# EAGLE design laser_buck_driver (EAGLE 7.6.0)
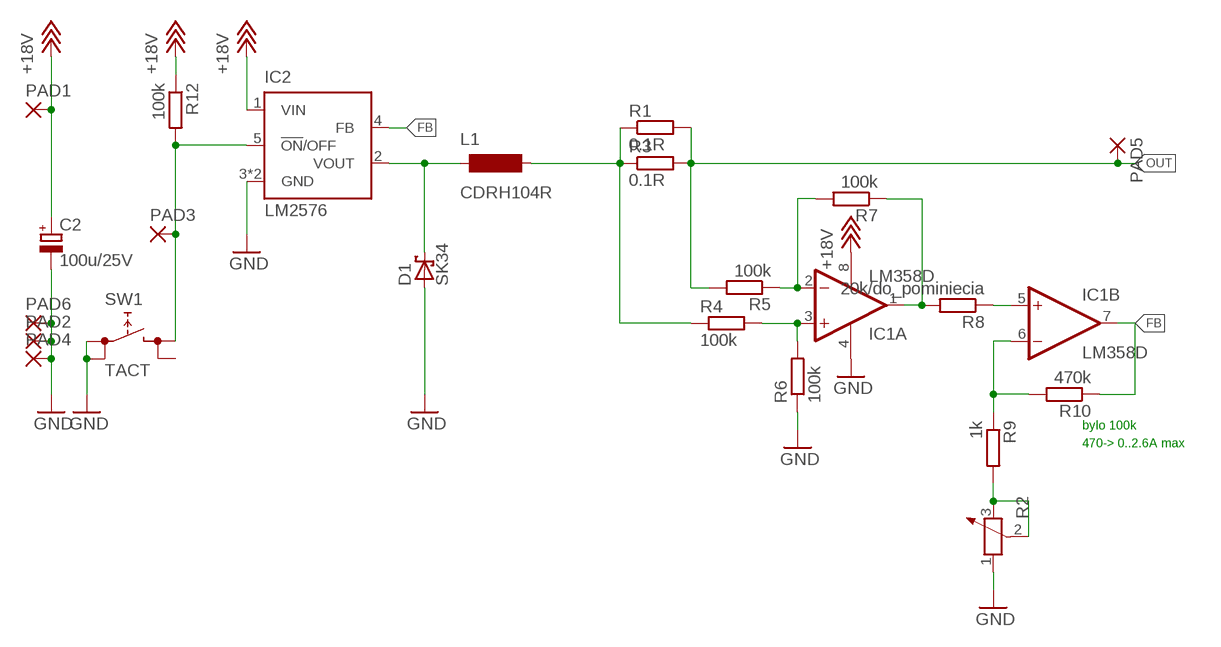
[diagram p0: schematic, sheet 1]

## Parts
C2  100u/25V  CPOL-EU153CLV-0810  [153CLV-0810]
D1  SK34  [SMA(DO214-AC)]
IC1  LM358D  [SO08]
IC2  LM2576  [TO263-5]
L1  CDRH104R  [CDRH104-R]
PAD1  SMD2  [SMD1,27-2,54]
PAD2  SMD2  [SMD1,27-2,54]
PAD3  SMD2  [SMD1,27-2,54]
PAD4  SMD2  [SMD1,27-2,54]
PAD5  SMD2  [SMD1,27-2,54]
PAD6  SMD2  [SMD1,27-2,54]
R1  0.1R  R-EU_R1206  [R1206]
R2  POTENTIOMETER_  [RTRIM_SMD_CUSTOM]
R3  0.1R  R-EU_R1206  [R1206]
R4  100k  R-EU_R0805  [R0805]
R5  100k  R-EU_R0805  [R0805]
R6  100k  R-EU_R0805  [R0805]
R7  100k  R-EU_R0805  [R0805]
R8  20k/do_pominiecia  R-EU_R0805  [R0805]
R9  1k  R-EU_R0805  [R0805]
R10  470k  R-EU_R0805  [R0805]
R12  100k  R-EU_R1206  [R1206]
SW1  TACT  [TACT]

## Nets
22K: IC1.5(B:+IN) R8.1
+18V: C2.+ IC1.8(P:V+) IC2.1(VIN) PAD1.1(P) R12.1
FB: IC1.7(B:OUT) IC2.4(FB) R10.1
GND: C2.- D1.A IC1.4(P:V-) IC2.3(GND) IC2.6(GND) PAD2.1(P) PAD4.1(P) PAD6.1(P) R2.1 R6.1 SW1.1 SW1.4
N$1: D1.C IC2.2(VOUT) L1.1
N$2: IC2.5(!ON!/OFF) PAD3.1(P) R12.2 SW1.2
N$3: IC1.1(A:OUT) R7.1 R8.2
N$8: L1.2 R1.1 R3.1 R4.1
N$11: IC1.6(B:-IN) R9.1 R10.2
N$12: IC1.2(A:-IN) R5.1 R7.2
N$13: IC1.3(A:+IN) R4.2 R6.2
N$15: R2.2 R2.3 R9.2
OUT: PAD5.1(P) R1.2 R3.2 R5.2
Unconnected: SW1.3

## Notes on the sheet
- bylo 100k
- 470-> 0..2.6A max

## Library data of the parts
C2 = rcl:CPOL-EU: POLARIZED CAPACITOR, European symbol
D1 = miscrel:SK34: Schottky barrier rectifier diode 3A, 40V
IC1 = linear:LM358: OP AMP also LM158; LM258; LM2904 Source: http://cache.national.com/ds/LM/LM158.pdf
IC2 = TI:LM2576: Simple Switch buck, step down dc-dc converter 3A, 40V
L1 = miscrel:CDRH104R: Shielded POWER inductor SMD for DC-DC converters 1A current
PAD1-PAD6 = wirepad:SMD2: SMD PAD
R1 R3-R10 = rcl:R-EU_: RESISTOR, European symbol
R2 = rcl:POTENTIOMETER_: Potentiometer custom SMD pads
R12 = resistor:R-EU_: RESISTOR, European symbol
SW1 = miscrel:TACT: SMD tactile switch, normally open

## Board
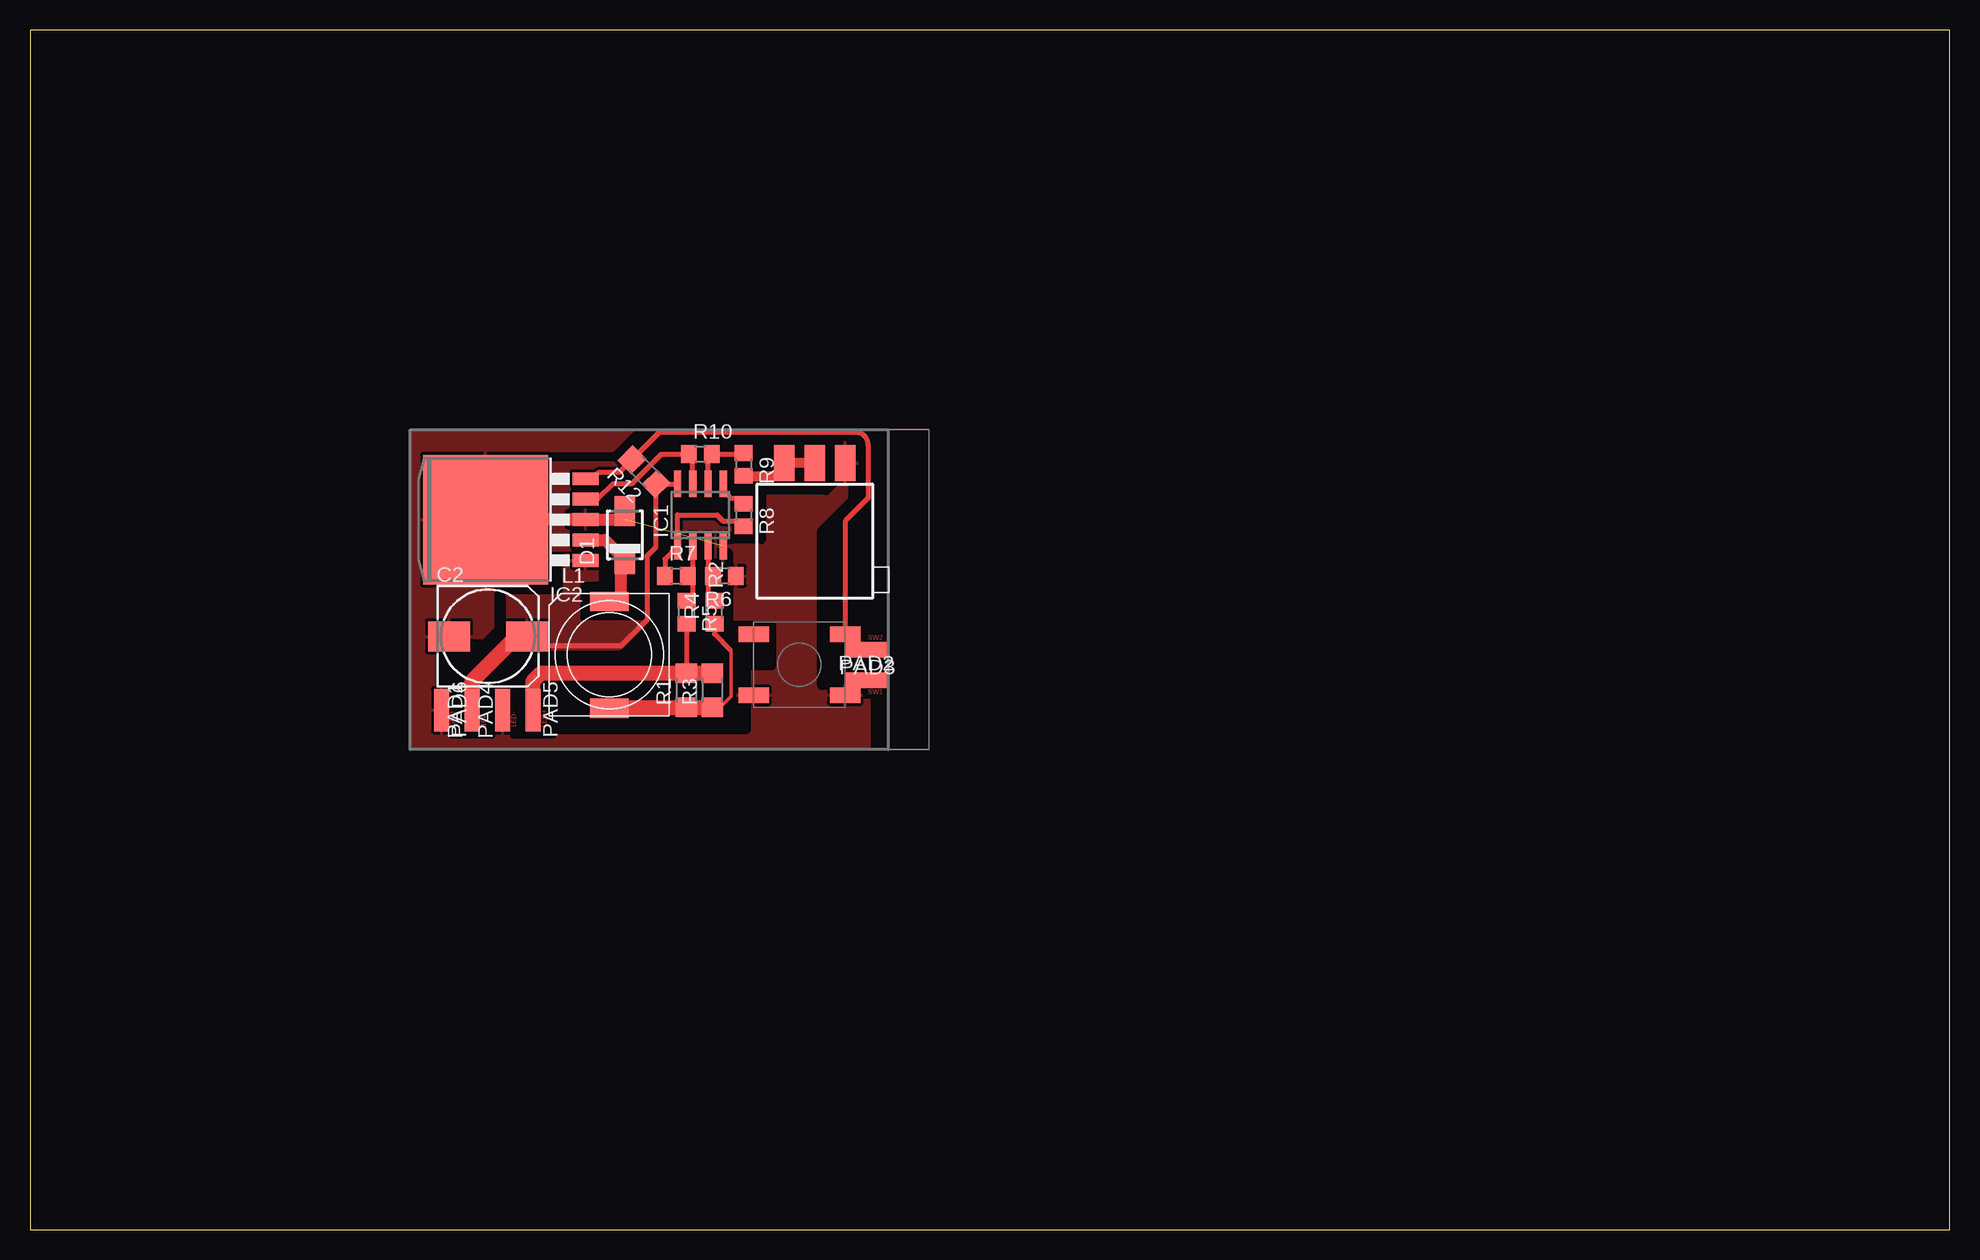
[diagram p1: board, top side]

Size 160 x 100 mm. Coordinates in mm from the lower left corner, seen from the top.
Outline: 0,0 160,0 160,100 0,100 0,0
Copper layers (1*16): Top 0.035mm / dielectric 1.5mm / Bottom 0.035mm
Design rules "default": minimum track width 10mil, minimum drill 24mil, track to track 8mil, track to pad 8mil, pad to pad 8mil, via to via 8mil, smd to smd 8mil, copper to edge 40mil, drill to drill 8mil, minimum pad ring 10mil, minimum via ring 8mil, stop-mask expansion 4mil, vias tented up to drill 0mil, thermal gap 10mil
tRestrict: area 40.1,41.7 to 40.7,43.4; area 42.6,41.7 to 43.3,43.4; area 47.6,57.8 to 50.8,61.6; area 61.9,62.4 to 67.4,66; area 69.6,44.5 to 70.9,45.2; area 69.6,49 to 70.9,49.6; area 66.7,45.7 to 71.1,48.3; area 40.3,41.2 to 43.6,44; area 35.2,41.2 to 38.5,44; 23 lines

### Footprints (pad centres in the part's own frame; a part is rotated, then mirrored left to right if it is on the bottom)
153CLV-0810 = smd 3.5 x 2.5: + 3.25,0; - -3.25,0
SMA(DO214-AC) = smd 2.5 x 1.7: A 2,0; C -2,0
SO08 = smd 0.6 x 2.2: 1 -1.905,-2.6; 2 -0.635,-2.6; 3 0.635,-2.6; 4 1.905,-2.6; 5 1.905,2.6; 6 0.635,2.6; 7 -0.635,2.6; 8 -1.905,2.6
TO263-5 = smd 1.067 x 2.159: 1 -3.404,-7.061; 2 -1.702,-7.061; 3 0,-7.061; 4 1.702,-7.061; 5 3.404,-7.061 | smd 10.8 x 10.41: 6 0,1.27
CDRH104-R = smd 3.2 x 1.6: 1 0,4.45; 2 0,-4.45
SMD1,27-2,54 = smd 1.27 x 3.54: 1 0,0
R1206 = smd 1.6 x 1.803: 1 -1.422,0; 2 1.422,0
RTRIM_SMD_CUSTOM = smd 3 x 1.7: 1 6.35,-2.54; 2 6.35,0; 3 6.35,2.54
R0805 = smd 1.3 x 1.5: 1 -0.95,0; 2 0.95,0
TACT = smd 1.27 x 2.54: 1 -2.54,-3.81; 2 2.54,-3.81; 3 2.54,3.81; 4 -2.54,3.81

### Placement (x,y rotation side)
C2  38.18,49.45 0 top
D1  49.58,57.91 90 top
IC1  55.88,59.56 0 top
IC2  39.24,59.18 90 top
L1  48.29,47.9 0 top
PAD1  36.86,43.31 0 top
PAD2  69.75,45.8 270 top
PAD3  69.75,48.34 90 top
PAD4  39.4,43.31 0 top
PAD5  41.94,43.31 180 top
PAD6  34.32,43.31 180 top
R1  54.71,44.96 90 top
R2  65.41,57.53 90 top
R3  56.87,44.96 90 top
R4  57.05,51.46 90 top
R5  54.71,51.46 270 top
R6  57.89,54.48 180 top
R7  53.87,54.48 0 top
R8  59.49,59.56 270 top
R9  59.49,63.78 270 top
R10  55.88,64.64 0 top
R12  51.18,63.17 135 top
SW1  64.14,47.09 90 top

### Tracks (layer width: path | path; a pad name or v marks a point on that pad's centre or on a via)
22K
  Top 0.406: IC1.5 57.78,61.59 58.42,60.96 59.04,60.96 R8.1
+18V
  Top 0.406: IC1.8 R12.1 52.19,56.89 51.44,56.13 51.44,50.8 49.28,48.64 41.43,48.64 C2.+
  Top 1.27: C2.+ 40.56,49.45 36.85,45.74 PAD1.1
  pour Top: 44.58,56.21 47.27,56.21 47.27,54.1 45.72,54.1 45.72,50.67 51.44,50.67 49.1,48.34 39.8,48.34 39.8,52.86 44.58,52.86
FB
  Top 0.305: 55.24,64.32 R10.1
  Top 0.406: IC1.7 55.24,64.32 | R10.1 52.65,64.64 50.16,62.15 48.59,62.15 47.32,60.88 IC2.4
GND  (1 unrouted)
  Top 0.406: SW1.1 69.19,45.8 PAD2.1
  Top 1.016: IC2.6 IC2.3 49.58,59.18 D1.A
  pour Top (isolate 0.254): 31.83,40.13 31.83,66.55 69.95,66.55 69.95,40.13 40.31,40.13 40.31,47.62 52.07,47.62 52.07,56.59 43.05,56.59 43.05,53.9 38.56,53.9 38.56,50.14 36.75,48.34 33.66,48.34 33.66,45.09 34.92,45.09 34.92,40.79 37.59,40.79 37.59,44.35 40.28,44.35 40.28,40.13
N$1
  Top 1.016: L1.1 49.25,52.35 49.25,55.48 D1.C 49.43,55.98 47.93,57.48 IC2.2
N$2
  Top 0.406: IC2.5 46.86,62.59 47.4,63.12 49.12,63.12 R12.2 52.47,66.47 68.81,66.47 arc-90 69.85,65.43 69.85,60.96 67.94,59.05 SW1.2 69.24,48.34 PAD3.1
N$3
  Top 0.305: 59.49,58.93 R8.2
  Top 0.406: R7.1 52.92,55.91 IC1.1 53.98,59.56 57.28,59.56 57.78,59.05 59.05,59.05 R8.2
N$8
  Top 0.305: 56.87,43.79 R3.1 57.51,43.54 58.42,44.45 58.42,48.26 58.37,48.31
  Top 0.406: R4.1 57.05,49.63 58.37,48.31
  Top 1.27: R3.1 R1.1 48.37,43.54 L1.2
N$11
  Top 0.305: 56.52,64.33 R10.2 | 59.49,64.64 R9.1
  Top 0.406: IC1.6 56.52,64.33 | R10.2 59.49,64.64
N$12
  Top 0.305: 55.24,52.41 R5.1 | R7.2 55.24,54.48
  Top 0.406: IC1.2 55.24,54.48 55.24,52.41
N$13
  Top 0.305: 56.52,52.41 R4.2 | R6.2 56.52,54.48
  Top 0.406: IC1.3 56.52,54.48 56.52,52.41
N$15
  Top 0.813: R2.2 R2.3 62.87,62.83 R9.2
OUT
  Top 0.305: 56.87,46.13 R3.2
  Top 0.406: R5.2 R1.2
  Top 1.27: R3.2 R1.2 42.59,46.38 41.94,45.72 PAD5.1

### Text on the board
Top: SW2 | SW1 | GND | 16V | LED- | LED+